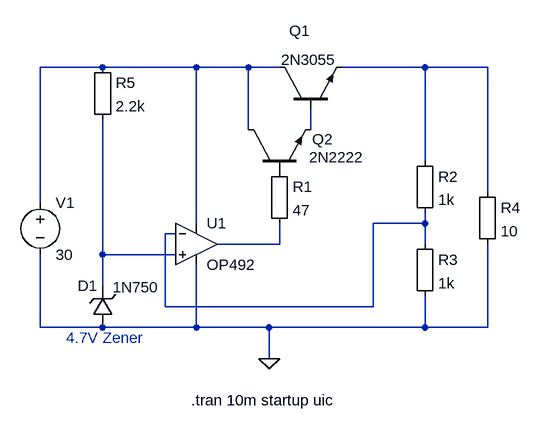
[diagram p0: schematic Linear1.asc]
Linear1.asc, the LTspice schematic file:
Version 4
SHEET 1 880 680
WIRE 48 -112 -48 -112
WIRE 192 -112 48 -112
WIRE 272 -112 192 -112
WIRE 320 -112 272 -112
WIRE 544 -112 416 -112
WIRE 640 -112 544 -112
WIRE 272 -16 272 -112
WIRE 368 -16 368 -48
WIRE 544 32 544 -112
WIRE 640 80 640 -112
WIRE -48 96 -48 -112
WIRE 192 128 192 -112
WIRE 544 128 544 112
WIRE 544 128 464 128
WIRE 160 144 144 144
WIRE 320 160 320 128
WIRE 320 160 224 160
WIRE 544 160 544 128
WIRE 48 176 48 -32
WIRE 160 176 48 176
WIRE 48 224 48 176
WIRE 144 256 144 144
WIRE 464 256 464 128
WIRE 464 256 144 256
WIRE -48 288 -48 176
WIRE 48 288 -48 288
WIRE 192 288 192 192
WIRE 192 288 48 288
WIRE 304 288 192 288
WIRE 544 288 544 240
WIRE 544 288 304 288
WIRE 640 288 640 160
WIRE 640 288 544 288
WIRE 304 336 304 288
FLAG 304 336 0
SYMBOL Opamps\\OP492 192 96 R0
SYMATTR InstName U1
SYMBOL npn 320 -48 R270
WINDOW 0 120 15 VRight 2
WINDOW 3 76 3 VRight 2
SYMATTR InstName Q1
SYMATTR Value 2N3055
SYMBOL Misc\\EuropeanResistor 304 32 R0
SYMATTR InstName R1
SYMATTR Value 47
SYMBOL Misc\\EuropeanResistor 528 16 R0
SYMATTR InstName R2
SYMATTR Value 1k
SYMBOL Misc\\EuropeanResistor 528 144 R0
SYMATTR InstName R3
SYMATTR Value 1k
SYMBOL Misc\\EuropeanResistor 624 64 R0
SYMATTR InstName R4
SYMATTR Value 10
SYMBOL voltage -48 80 R0
WINDOW 123 0 0 Left 0
WINDOW 39 0 0 Left 0
SYMATTR InstName V1
SYMATTR Value 30
SYMBOL zener 64 288 R180
WINDOW 0 24 64 Left 2
WINDOW 3 -71 62 Left 2
SYMATTR InstName D1
SYMATTR Value 1N750
SYMBOL Misc\\EuropeanResistor 32 -128 R0
SYMATTR InstName R5
SYMATTR Value 2.2k
SYMBOL npn 272 48 R270
WINDOW 0 49 98 VRight 2
WINDOW 3 22 94 VRight 2
SYMATTR InstName Q2
SYMATTR Value 2N2222
TEXT 184 400 Left 2 !.tran 10m startup uic
TEXT -8 304 Left 2 ;4.7V Zener

The netlist it stands for:
* Linear1.asc
XU1 N006 N004 N001 0 N005 OP492  ; pins In+ In- V+ V- OUT
Q1 N001 N003 N002 0 2N3055
R1 P001 N005 47
R2 N002 N004 1k
R3 N004 0 1k
R4 N002 0 10
V1 N001 0 30
D1 0 N006 1N750
R5 N001 N006 2.2k
Q2 N001 P001 N003 0 2N2222
.model D D
.lib standard.dio
.model NPN NPN
.model PNP PNP
.lib standard.bjt
.tran 10m startup uic
* 4.7V Zener
.backanno
.end